# EAGLE design RecordStatusShield (EAGLE 6.3)
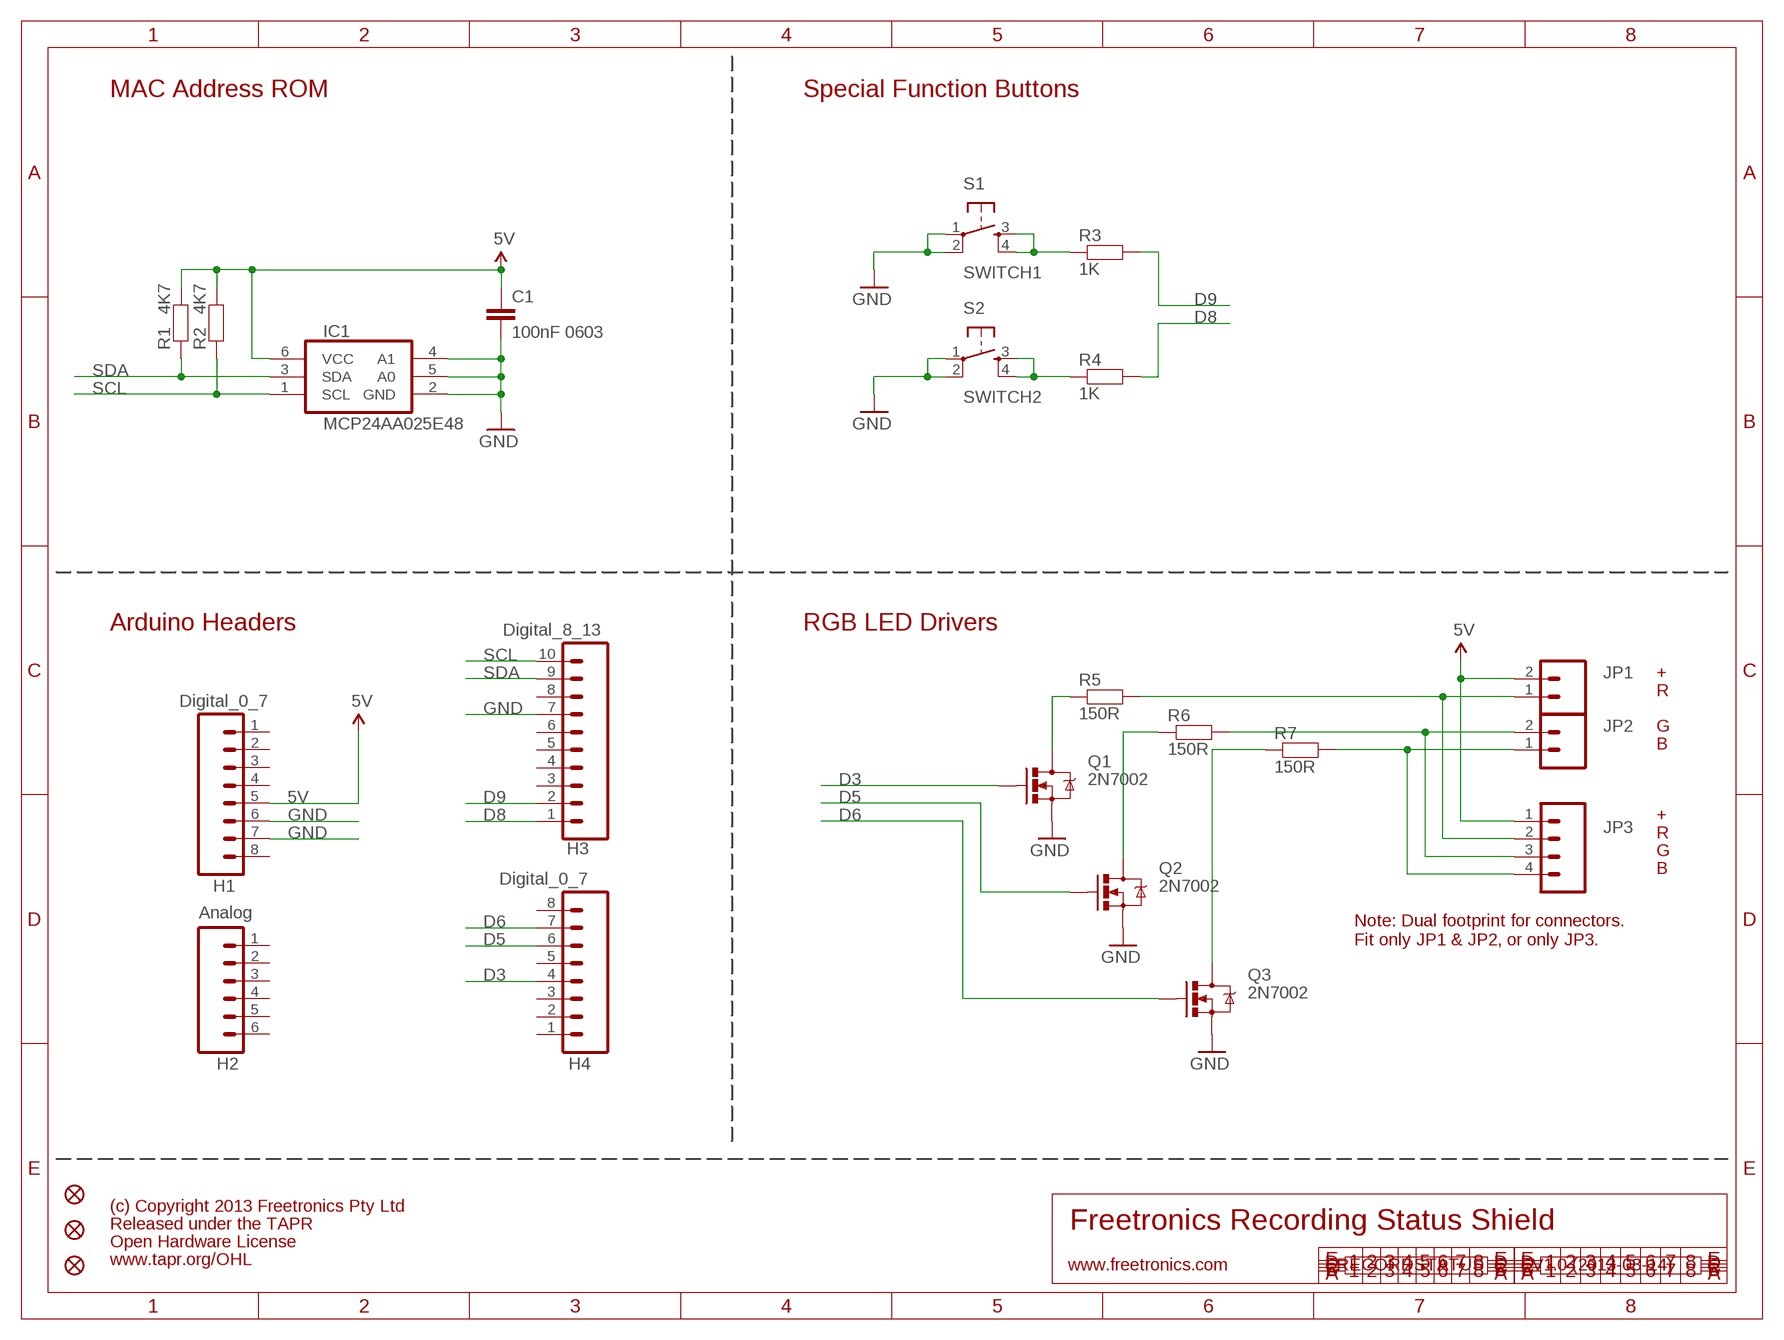
[diagram p0: schematic, sheet 1]

## Parts
C1  100nF 0603  C-EUC0603  [C0603]
FID5  FIDUCIAL1X2.5  [FIDUCIAL-1X2.5]
FID6  FIDUCIAL1X2.5  [FIDUCIAL-1X2.5]
FID7  FIDUCIAL1X2.5  [FIDUCIAL-1X2.5]
H1  Digital_0_7  M08  [1X08]
H2  Analog  M06SIP  [1X06]
H3  Digital_8_13  M100.1  [1X10]
H4  Digital_0_7  M08  [1X08]
IC1  MCP24AA025E48  [SOT23-6]
JP1  M025MM  [SCREWTERMINAL-5MM-2]
JP2  M025MM  [SCREWTERMINAL-5MM-2]
JP3  M04PTH  [1X04]
Q1  2N7002  MOSFET-NCHANNELSMD  [SOT23-3]
Q2  2N7002  MOSFET-NCHANNELSMD  [SOT23-3]
Q3  2N7002  MOSFET-NCHANNELSMD  [SOT23-3]
R1  4K7  RESISTOR0603  [0603]
R2  4K7  RESISTOR0603  [0603]
R3  1K  RESISTOR0603  [0603]
R4  1K  RESISTOR0603  [0603]
R5  150R  RESISTOR0603  [0603]
R6  150R  RESISTOR0603  [0603]
R7  150R  RESISTOR0603  [0603]
S1  SWITCH1  TAC_SWITCHPTH  [TACTILE-PTH]
S2  SWITCH2  TAC_SWITCHPTH  [TACTILE-PTH]

## Nets
5V: C1.1 H1.5 IC1.6(VCC) JP1.2 JP3.1 R1.2 R2.2
D3: H4.4 Q1.1(G)
D5: H4.6 Q2.1(G)
D6: H4.7 Q3.1(G)
D8: H3.1 R4.2
D9: H3.2 R3.2
GND: C1.2 H1.6 H1.7 H3.7 IC1.2(GND) IC1.4(A1) IC1.5(A0) Q1.2(S) Q2.2(S) Q3.2(S) S1.1 S1.2 S2.1 S2.2
N$1: R3.1 S1.3 S1.4
N$2: R4.1 S2.3 S2.4
N$3: JP2.1 JP3.4 R7.2
N$4: JP2.2 JP3.3 R6.2
N$5: JP1.1 JP3.2 R5.2
N$7: Q1.3(D) R5.1
N$8: Q2.3(D) R6.1
N$9: Q3.3(D) R7.1
SCL: H3.10 IC1.1(SCL) R2.1
SDA: H3.9 IC1.3(SDA) R1.1
Unconnected: H1.1 H1.2 H1.3 H1.4 H1.8 H2.1 H2.2 H2.3 H2.4 H2.5 H2.6 H3.3 H3.4 H3.5 H3.6 H3.8 H4.1 H4.2 H4.3 H4.5 H4.8

## Notes on the sheet
- MAC Address ROM | Special Function Buttons
- Arduino Headers | RGB LED Drivers
- +
- R
- G
- B
- +
- R
- G
- B
- Note: Dual footprint for connectors.
  Fit only JP1 & JP2, or only JP3.
- (c) Copyright 2013 Freetronics Pty Ltd
- Released under the TAPR | Freetronics Recording Status Shield
- Open Hardware License
- www.tapr.org/OHL
- www.freetronics.com | RECORDSTATUS | V1.0 (2013-03-14)

## Library data of the parts
C1 = freetronics-jon:C-EU: CAPACITOR, European symbol
FID5-FID7 = freetronics:FIDUCIAL: Fiducial Alignment Points Various fiducial points for machine vision alignment.
H1 H4 = freetronics:M08: Header 8 Standard 8-pin 0.1" header. Use with straight break away headers (SKU : PRT-00116), right angle break away headers (PRT-00553), swiss pins (PRT-00743), machine pins (PRT-00117), and female headers (PRT-00115).
H2 = freetronics:M06: Header 6 Standard 6-pin 0.1" header. Use with straight break away headers (SKU : PRT-00116), right angle break away headers (PRT-00553), swiss pins (PRT-00743), machine pins (PRT-00117), and female headers (PRT-00115). Molex polarized connector foot print use with SKU : PRT-08094 with associated crimp pins and housings. NOTES ON THE VARIANTS LOCK and LOCK_LONGPADS... This footprint was designed to help hold the alignment of a through-hole component (i.e. 6-pin header) while soldering it into place. You may notice that each hole has been shifted either up or down by 0.005 of an inch from it's more standard position (which is a perfectly straight line). This slight alteration caused the pins (the squares in the middle) to touch the edges of the holes. Because they are alternating, it causes a "brace" to hold the component in place. 0.005 has proven to be the perfect amount of "off-center" position when using our standard breakaway headers. Although looks a little odd when you look at the bare footprint, once you have a header in there, the alteration is very hard to notice. Also, if you push a header all the way into place, it is covered up entirely on the bottom side. This idea of altering the position of holes to aid alignment will be further integrated into the Sparkfun Library for other footprints. It can help hold any component with 3 or more connection pins.
H3 = freetronics-original:M10: Header 10 Standard 10-pin 0.1" header. Use with straight break away headers (SKU : PRT-00116), right angle break away headers (PRT-00553), swiss pins (PRT-00743), machine pins (PRT-00117), and female headers (PRT-00115).
IC1 = freetronics-jon:MCP24AA025E48
JP1 JP2 = SparkFun:M02: Header 2 Standard 2-pin 0.1" header. Use with straight break away headers (SKU : PRT-00116), right angle break away headers (PRT-00553), swiss pins (PRT-00743), machine pins (PRT-00117), and female headers (PRT-00115). Molex polarized connector foot print use with SKU : PRT-08233 with associated crimp pins and housings.
JP3 = freetronics-master-v1.1:M04: Header 4 Standard 4-pin 0.1" header. Use with straight break away headers (SKU : PRT-00116), right angle break away headers (PRT-00553), swiss pins (PRT-00743), machine pins (PRT-00117), and female headers (PRT-00115). Molex polarized connector foot print use with SKU : PRT-08231 with associated crimp pins and housings.
Q1-Q3 = freetronics-master-v1:MOSFET-NCHANNEL
R1-R7 = freetronics-jon:RESISTOR: Resistor Basic schematic elements and footprints for 0603, 1206, and PTH 1/10th watt (small) resistors.
S1 S2 = freetronics:TAC_SWITCH: Momentary Switch Button commonly used for reset or general input. Spark Fun Electronics SKU : COM-00097

## Board
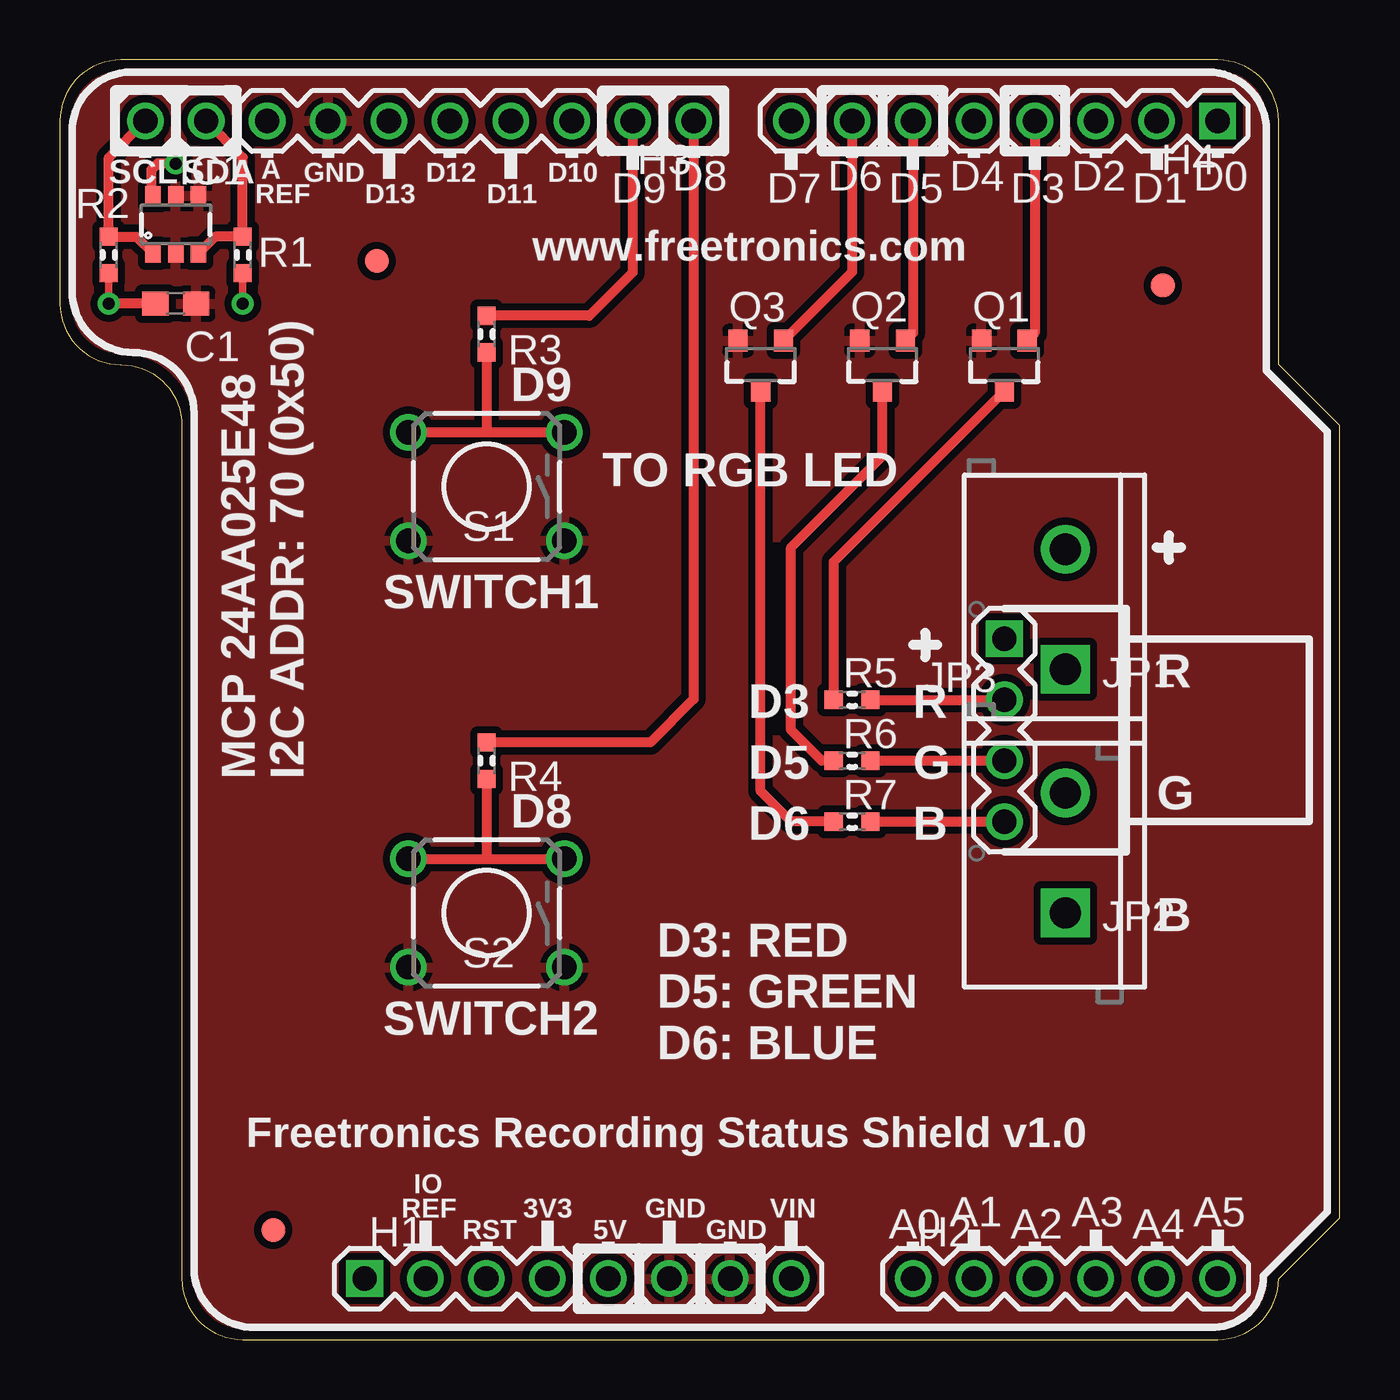
[diagram p1: board, top side]
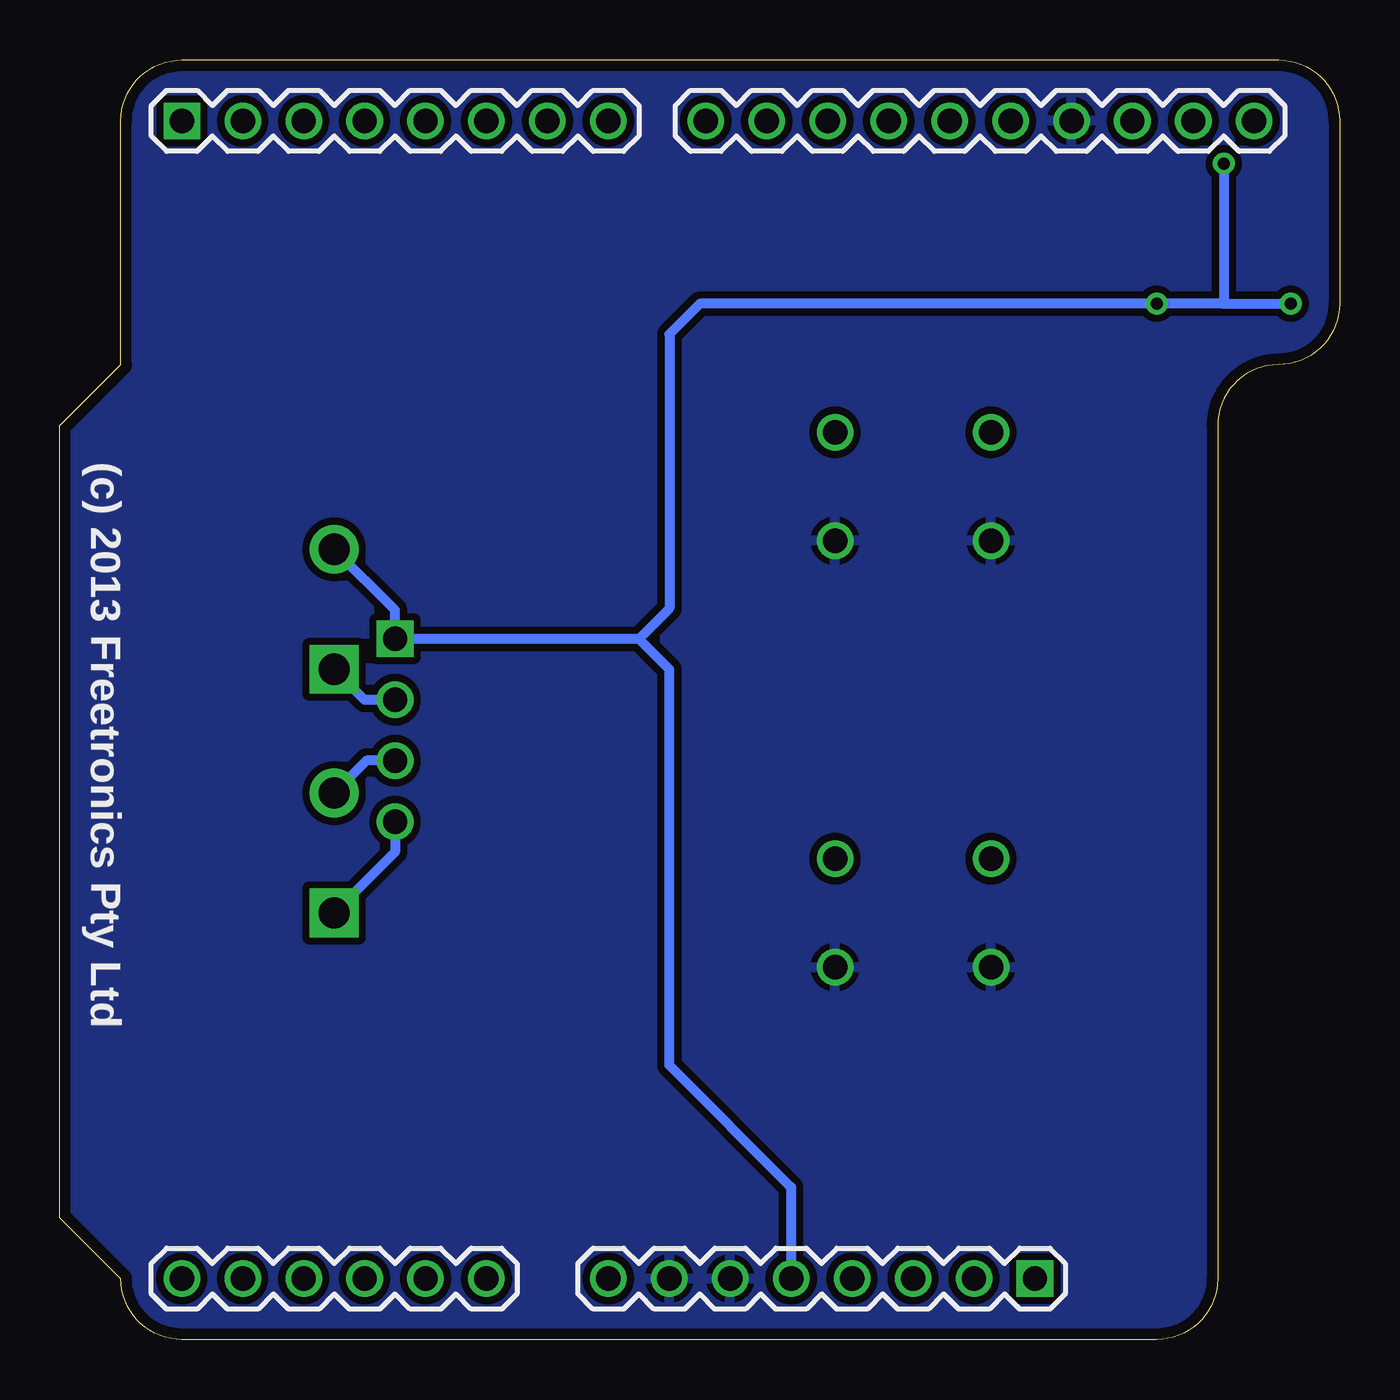
[diagram p2: board, bottom side, seen from below]

Size 53.34 x 53.34 mm. Coordinates in mm from the lower left corner, seen from the top.
Outline: 5.08,2.54 arc90 7.62,0 48.26,0 arc90 50.8,2.54 53.34,5.08 53.34,38.1 50.8,40.64 50.8,50.8 arc90 48.26,53.34 2.54,53.34 arc90 0,50.8 0,43.18 arc90 2.54,40.64 arc-90 5.08,38.1 5.08,2.54
Copper layers (1*16): Top 0.035mm / dielectric 1.5mm / Bottom 0.035mm
Design rules "default *": minimum track width 10mil, minimum drill 24mil, track to track 12mil, track to pad 12mil, pad to pad 12mil, via to via 12mil, smd to smd 8mil, copper to edge 18mil, drill to drill 8mil, minimum pad ring 10mil, minimum via ring 8mil, stop-mask expansion 4mil, vias tented up to drill 0mil, thermal gap 10mil

### Footprints (pad centres in the part's own frame; a part is rotated, then mirrored left to right if it is on the bottom)
C0603 = smd 1.1 x 1: 1 -0.85,0; 2 0.85,0
FIDUCIAL-1X2.5 = smd 1 x 1: 1 0,0
1X08 = drill 1.016 square: 1 0,0 | drill 1.016: 2 2.54,0; 3 5.08,0; 4 7.62,0; 5 10.16,0; 6 12.7,0; 7 15.24,0; 8 17.78,0
1X06 = drill 1.016: 1 0,0; 2 2.54,0; 3 5.08,0; 4 7.62,0; 5 10.16,0; 6 12.7,0
1X10 = drill 1.016: 1 0,0; 2 2.54,0; 3 5.08,0; 4 7.62,0; 5 10.16,0; 6 12.7,0; 7 15.24,0; 8 17.78,0; 9 20.32,0; 10 22.86,0
SOT23-6 = smd 0.65 x 0.8: 1 -0.95,-1.2; 2 0,-1.2; 3 0.95,-1.2; 4 0.95,1.2; 5 0,1.2; 6 -0.95,1.2
SCREWTERMINAL-5MM-2 = drill 1.3 pad 2.032 square: 1 0,0 | drill 1.3 pad 2.032: 2 5,0
1X04 = drill 1.016 square: 1 0,0 | drill 1.016: 2 2.54,0; 3 5.08,0; 4 7.62,0
SOT23-3 = smd 0.8 x 0.9: 1 -0.95,-1; 2 0.95,-1; 3 0,1.1
0603 = smd 0.762 x 0.762: 1 -0.762,0; 2 0.762,0
TACTILE-PTH = drill 1.016: 1 -3.251,2.261; 2 3.251,2.261; 3 -3.251,-2.261; 4 3.251,-2.261

### Placement (x,y rotation side)
C1  4.83,43.18 0 top
FID5  8.89,4.57 0 top
FID6  45.97,43.94 0 top
FID7  13.21,44.96 0 top
H1  12.7,2.54 0 top
H2  35.56,2.54 0 top
H3  26.42,50.8 180 top
H4  48.26,50.8 180 top
IC1  4.83,46.48 0 top
JP1  41.91,27.94 90 top
JP2  41.91,17.78 90 top
JP3  39.37,29.21 270 top
Q1  39.37,40.64 180 top
Q2  34.29,40.64 180 top
Q3  29.21,40.64 180 top
R1  7.62,45.21 270 top
R2  2.03,45.21 270 top
R3  17.78,41.91 90 top
R4  17.78,24.13 90 top
R5  33.02,26.67 0 top
R6  33.02,24.13 0 top
R7  33.02,21.59 0 top
S1  17.78,35.56 180 top
S2  17.78,17.78 180 top

### Tracks (layer width: path | path; a pad name or v marks a point on that pad's centre or on a via)
5V  (via drill 0.5)
  Top 0.305: v2.03,43.18 R2.2 | v7.62,43.18 R1.2
  Top 0.406: C1.1 v2.03,43.18 | v4.83,49.02 4.06,49.02 3.81,48.77 3.81,47.75 IC1.6
  Bottom 0.406: v4.83,49.02 4.83,43.18 | 4.83,43.18 v2.03,43.18 | 4.83,43.18 v7.62,43.18 26.67,43.18 27.94,41.91 27.94,30.48 29.21,29.21 | 29.21,29.21 27.94,27.94 27.94,11.43 22.86,6.35 H1.5 | 29.21,29.21 JP3.1 39.37,30.4 JP1.2
D3
  Top 0.406: H4.4 40.64,41.96 Q1.1
D5
  Top 0.406: H4.6 35.56,41.96 Q2.1
D6
  Top 0.406: H4.7 33.02,44.5 Q3.1
D8
  Top 0.406: H3.1 26.42,26.7 24.61,24.89 R4.2
D9
  Top 0.406: H3.2 23.88,44.48 22.07,42.67 R3.2
GND
  pour Bottom: 0,50.8 arc-74 2.54,53.34 48.26,53.34 arc-74 50.8,50.8 50.8,40.64 53.34,38.1 53.34,5.08 50.8,2.54 arc-74 48.26,0 7.62,0 arc-74 5.08,2.54 5.08,38.1 arc90 2.54,40.64 arc-90 0,43.18
  pour Top: 0,50.8 arc-74 2.54,53.34 48.26,53.34 arc-74 50.8,50.8 50.8,40.64 53.34,38.1 53.34,5.08 50.8,2.54 arc-74 48.26,0 7.62,0 arc-74 5.08,2.54 5.08,38.1 arc90 2.54,40.64 arc-90 0,43.18
N$1
  Top 0.406: S1.4 17.78,37.82 | 17.78,37.82 S1.3 | R3.1 17.78,37.82
N$2
  Top 0.406: S2.4 17.78,20.04 | 17.78,20.04 S2.3 | R4.1 17.78,20.04
N$3
  Top 0.406: R7.2 JP3.4
  Bottom 0.406: JP3.4 39.37,20.32 JP2.1
N$4
  Top 0.406: R6.2 JP3.3
  Bottom 0.406: JP3.3 40.56,24.13 JP2.2
N$5
  Top 0.406: R5.2 JP3.2
  Bottom 0.406: JP3.2 40.64,26.67 JP1.1
N$7
  Top 0.406: R5.1 32.26,32.43 Q1.3
N$8
  Top 0.406: R6.1 31.75,24.13 30.48,25.4 30.48,33.02 34.29,36.83 Q2.3
N$9
  Top 0.406: R7.1 30.48,21.59 29.21,22.86 Q3.3
SCL
  Top 0.406: IC1.1 3.18,45.97 R2.1 2.03,49.28 H3.10
SDA
  Top 0.406: IC1.3 6.47,45.97 R1.1 7.62,49.28 H3.9

### Text on the board
tPlace: SCL | SDA | A | GND | D12 | D10 | D8 | D6 | D4 | D2 | D0 | REF | D13 | D11 | D9 | D7 | D5 | D3 | D1 | www.freetronics.com | D9 | TO RGB LED | SWITCH1 | R | D3 | R | MCP 24AA025E48 | I2C ADDR: 70 (0x50) | D5 | G | G | D8 | D6 | B | B | SWITCH2 | D3: RED / D5: GREEN / D6: BLUE | Freetronics Recording Status Shield v1.0 | IO | REF | 3V3 | GND | VIN | A1 | A3 | A5 | RST | 5V | GND | A0 | A2 | A4
bPlace: (c) 2013 Freetronics Pty Ltd